# Altium project Test SVN.PrjPcb
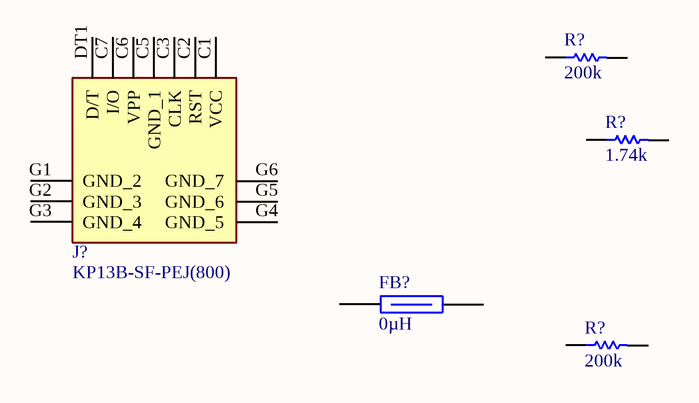
[diagram p0: Sheet2.SchDoc]
2 sheets, 7 parts. Net scope: global (net labels, ports and power ports of the same name join across sheets).
Board file: PCB1.PcbDoc
Sheets:
  Sheet2.SchDoc
  Sheet1.SchDoc

## Sheet Sheet2.SchDoc
size A; SheetNumber: 1; SheetTotal: 2

### Parts
(Parts that share a designator on the sheet are numbered #1, #2 ... from top to bottom, then left to right.)
FB?  value 0µH  [BLM18KG221SN1D]  (hidden comment: BLM18KG221SN1)
J?  KP13B-SF-PEJ(800)  [KP13B-SF-PEJ(800)]
R?#1  value 200k  [0402 RES]  (hidden comment: resistor_200K_005_0402)
R?#2  value 1.74k  [0402 RES]  (hidden comment: resistor_1K74_001_0402)
R?#3  value 200k  [0402 RES]  (hidden comment: resistor_200K_005_0402)

### Nets

Not connected (* = marked no-connect by the designer): FB? 1 2; J? C1(VCC) C2(RST) C3(CLK) C5(GND_1) C6(VPP) C7(I/O) DT1(D/T) G1(GND_2) G2(GND_3) G3(GND_4) G4(GND_5) G5(GND_6) G6(GND_7); R?#1 1 2; R?#2 1 2; R?#3 1 2

### Library data of the parts
FB? = CMP-006-00010-1: Ferrite Chip, 1 Function(s), 2.2A, 2 Pin(s); Manufacturer Series: BLM18K; Output Impedance: 220R; Min Frequency: 100MHz; Number of Functions: 1; RoHS Compliant: Yes; Filter Type: FERRITE CHIP; Case/Package: 0603; Mount: Surface Mount; Width: 0.8mm; Current Rating: 2.2A; Max Frequency: 100MHz; Min Operating Temperature: -55°C; Length: 1.6mm; Max Operating Temperature: 125°C; Case Code: 0603; Construction: Chip Bead; REACH SVHC: Yes; Material: Ferrite; Height: 0.8mm
J? = CMP-00028-00000-1: PCB Connector, Socket; Case/Package: NanoSIM
R?#1 R?#3 = CMP-009-00022-1: Fixed Resistor, Metal Glaze/thick Film, 0.1W, 200000ohm, 50V, 5% +/-Tol, 200ppm/Cel, Surface Mount, 0402; Case/Package: 0402; Tolerance: 5%; Voltage Value: 50V
R?#2 = CMP-009-00014-1: Fixed Resistor, Metal Glaze/thick Film, 0.0625W, 1740ohm, 50V, 1% +/-Tol, 100ppm/Cel, Surface Mount, 0402; Tolerance: 1%; Voltage Value: 50V; Case/Package: 0402

## Sheet Sheet1.SchDoc
size A; SheetNumber: 2; SheetTotal: 1
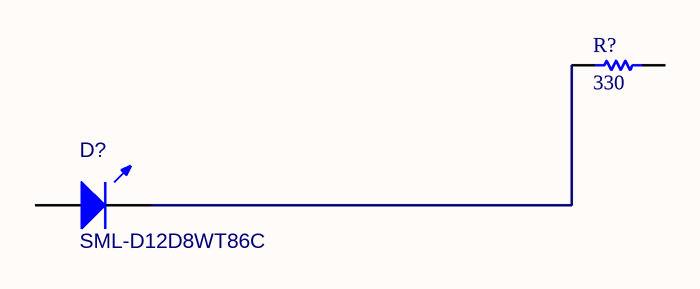
[diagram p1: Sheet1.SchDoc]

### Parts
(Parts that share a designator on the sheet are numbered #1, #2 ... from top to bottom, then left to right.)
D?  SML-D12D8WT86C  [LED 0603]
R?#4  value 330  [0603 RES]  (hidden comment: resistor_330_005_0603)

### Nets
NetD?_2: D?.2 R?#4.1

Not connected (* = marked no-connect by the designer): D? 1; R?#4 2

### Library data of the parts
D? = CMP-007-00004-1: Single Color LED; Forward Voltage Drop: 2.2V; Colour: Orange; Forward Current: 20mA; Case/Package: 0603
R?#4 = CMP-009-00006-3: Fixed Resistor, Metal Glaze/thick Film, 0.2W, 330ohm, 50V, 5% +/-Tol, 100ppm/Cel, Surface Mount, 0603; Voltage Value: 50; Tolerance: 5%; Case/Package: 0603